# Altium schematic sheet RFnetwork.SchDoc
size A4; SheetNumber: 5; SheetTotal: 8
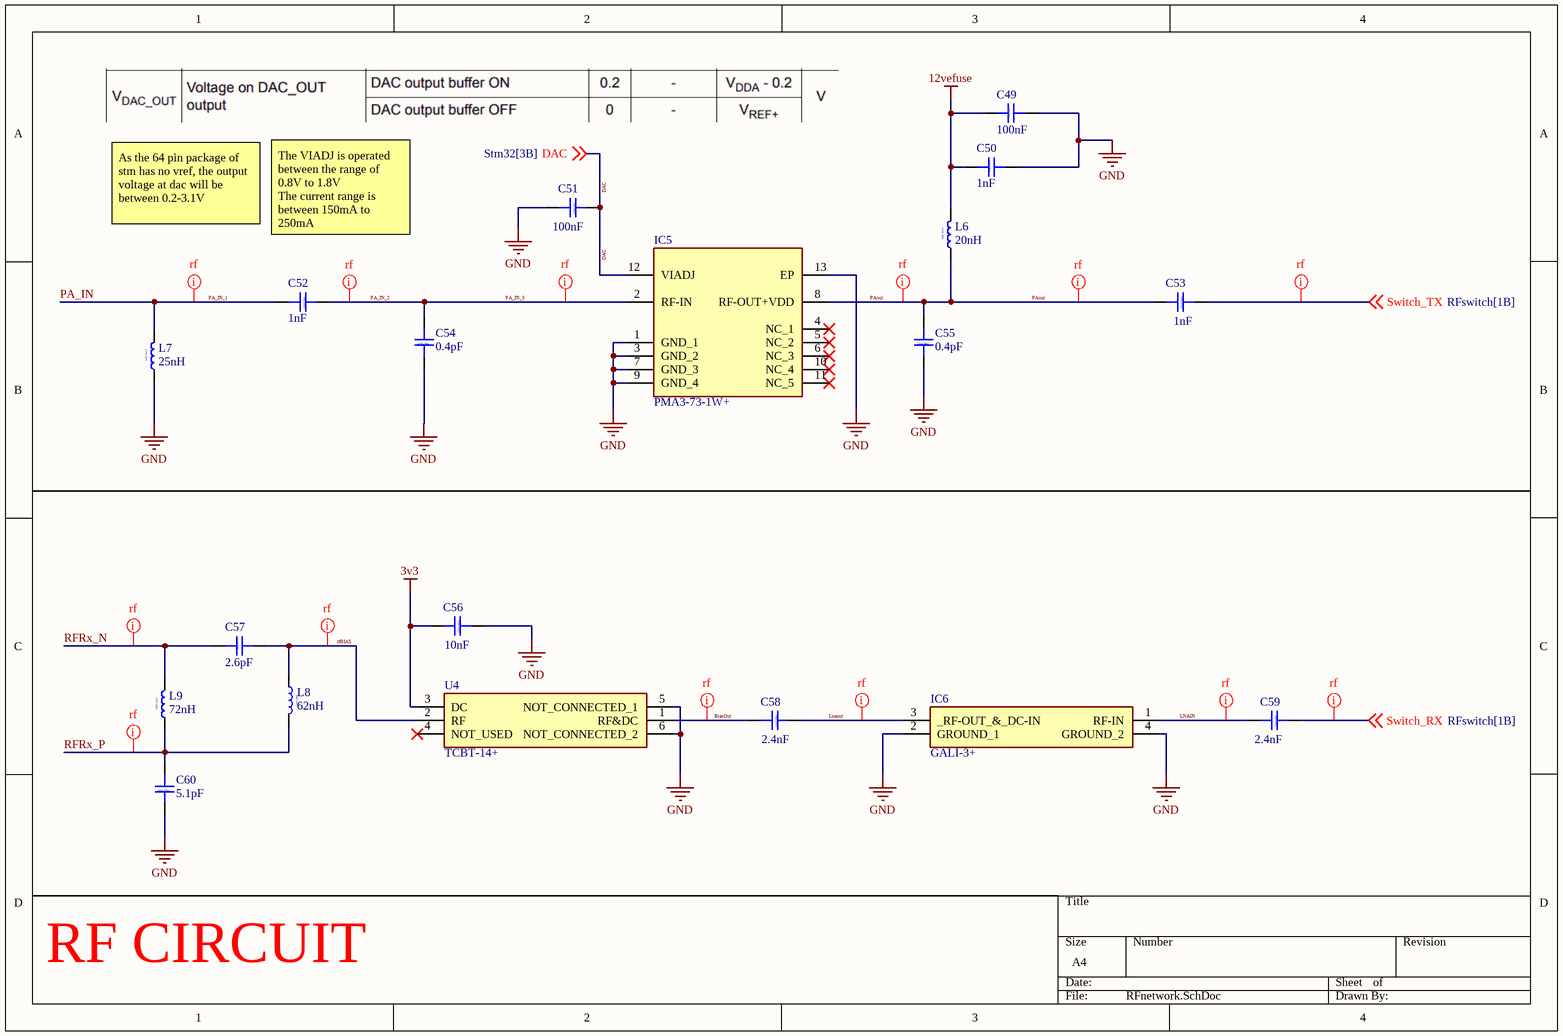
[diagram p0: RFnetwork.SchDoc]

## Parts
C49  100nF  [CAP_0603]
C50  1nF  [CAP_0603]
C51  100nF  [CAP_0603]
C52  1nF  [CAP_0603]
C53  1nF  [CAP_0603]
C54  0.4pF  [CAP_0603]
C55  0.4pF  [CAP_0603]
C56  10nF  [CAP_0603]
C57  2.6pF  [CAP_0402]
C58  2.4nF  [CAP_0603]
C59  2.4nF  [CAP_0603]
C60  5.1pF  [CAP_0402]
IC5  PMA3-73-1W+  [QFN51P300X300X89-13N]
IC6  GALI-3+  [GALI3]
L6  20nH  [IND_0603]
L7  25nH  [IND_0603]
L8  62nH  [IND_0402]
L9  72nH  [IND_0402]
U4  TCBT-14+  [TCBT14bias]

## Nets
3v3: C56.2 U4.3(DC)
12vefuse: C49.1 C50.1 L6.2
GND: C49.2 C50.2 C51.2 C54.1 C55.1 C56.1 C60.1 IC5.1(GND_1) IC5.3(GND_2) IC5.7(GND_3) IC5.9(GND_4) IC5.13(EP) IC6.2(GROUND_1) IC6.4(GROUND_2) L7.1 U4.5(NOT_CONNECTED_1) U4.6(NOT_CONNECTED_2)
BiasOut: C58.2 U4.1(RF&DC)
DAC: C51.1 IC5.12(VIADJ) ; off-sheet DAC
LNAIN: C59.2 IC6.1(RF-IN)
Lnaout: C58.1 IC6.3(_RF-OUT_&_DC-IN)
PA_IN: C52.2 L7.2  [also labelled PA_IN_1]
PA_IN_2: C52.1 C54.2 IC5.2(RF-IN)  [also labelled PA_IN_3]
PAout: C53.2 C55.2 IC5.8(RF-OUT+VDD) L6.1
rfBIAS: C57.2 L8.1 U4.2(RF)
RFRx_N: C57.1 L9.2
RFRx_P: C60.2 L8.2 L9.1
Switch_RX: C59.1 ; off-sheet Switch_RX
Switch_TX: C53.1 ; off-sheet Switch_TX

Not connected (* = marked no-connect by the designer): IC5 4(NC_1)* 5(NC_2)* 6(NC_3)* 10(NC_4)* 11(NC_5)*; U4 4(NOT_USED)*

## Layout directives
net class rf: BiasOut, LNAIN, Lnaout, PA_IN, PA_IN_2, PAout, rfBIAS, RFRx_N, RFRx_P, Switch_RX, Switch_TX

## Notes on the sheet
- As the 64 pin package of stm has no vref, the output voltage at dac will be between 0.2-3.1V
- The VIADJ is operated between the range of 0.8V to 1.8V
  The current range is between 150mA to 250mA
- RF CIRCUIT
- (in symbol Capacitor-SMD-0402) SMD 0402
- (in symbol Capacitor-SMD-0603) SMD 0603
- (in symbol Inductor-SMD-RF-0402) SMD 0402
- (in symbol Inductor-SMD-RF-0603) SMD 0603

## Library data of the parts
C49-C56 C58 C59 = Capacitor-SMD-0603: Capacitor SMD 0603 RATED
C57 C60 = Capacitor-SMD-0402: Capacitor SMD 0402 RATED
IC5 = PMA3-73-1W+: Integrated Circuit; Manufacturer_Name: Mini-Circuits; Datasheet Link: https://www.minicircuits.com/WebStore/dashboard.html?model=PMA3-73-1W%2B; Height: 0.89mm; Manufacturer_Part_Number: PMA3-73-1W+
IC6 = GALI-3+: Integrated Circuit; Manufacturer_Name: Mini-Circuits; Datasheet Link: https://www.mouser.com/datasheet/2/1030/GALI-3_2b-1700470.pdf; Height: 1.6mm; Manufacturer_Part_Number: GALI-3+; Mouser Part Number: 139-GALI-3; Mouser Price/Stock: https://www.mouser.co.uk/ProductDetail/Mini-Circuits/GALI-3%2b?qs=xZ%2FP%252Ba9zWqaN9gt7VIItFw%3D%3D
L6 L7 = Inductor-SMD-RF-0603: Inductor SMD 0603
L8 L9 = Inductor-SMD-RF-0402: Inductor SMD 0402
U4 = TCBT-14+: Undefined or Miscellaneous; Manufacturer_Name: Mini-Circuits; Datasheet Link: https://datasheet.datasheetarchive.com/originals/distributors/Datasheets_SAMA/5b6a26293074ceb01a848c930930d1aa.pdf; Height: 3.56mm; Manufacturer_Part_Number: TCBT-14+; Mouser Part Number: 139-TCBT-14; Mouser Price/Stock: https://www.mouser.co.uk/ProductDetail/Mini-Circuits/TCBT-14%2b?qs=xZ%2FP%252Ba9zWqZ8CC6RU0tY5w%3D%3D